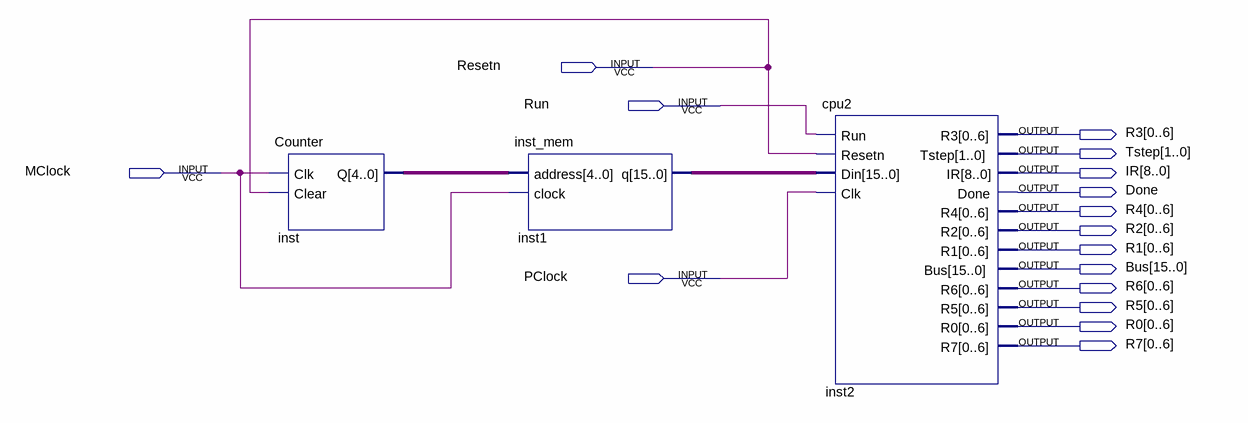
[diagram p0: schematic sheet]
// Quartus schematic part2.bdf as structural Verilog: 3 symbols, 16 pins
module part2 (
  input  Resetn,
  input  Run,
  input  MClock,
  input  PClock,
  output [0:6] R3,
  output [1:0] Tstep,
  output [8:0] IR,
  output Done,
  output [0:6] R4,
  output [0:6] R2,
  output [0:6] R1,
  output [15:0] Bus,
  output [0:6] R6,
  output [0:6] R5,
  output [0:6] R0,
  output [0:6] R7
);

  wire [4:0] inst_q;
  wire [15:0] inst1_q;

  Counter inst (.Clk(MClock), .Clear(Resetn), .Q(inst_q));
  inst_mem inst1 (.address(inst_q), .clock(MClock), .q(inst1_q));
  cpu2 inst2 (
    .Run(Run), .Resetn(Resetn), .Din(inst1_q), .Clk(PClock), .R3(R3), .Tstep(Tstep), .IR(IR), .Done(Done),
    .R4(R4), .R2(R2), .R1(R1), .Bus(Bus), .R6(R6), .R5(R5), .R0(R0), .R7(R7));
endmodule
